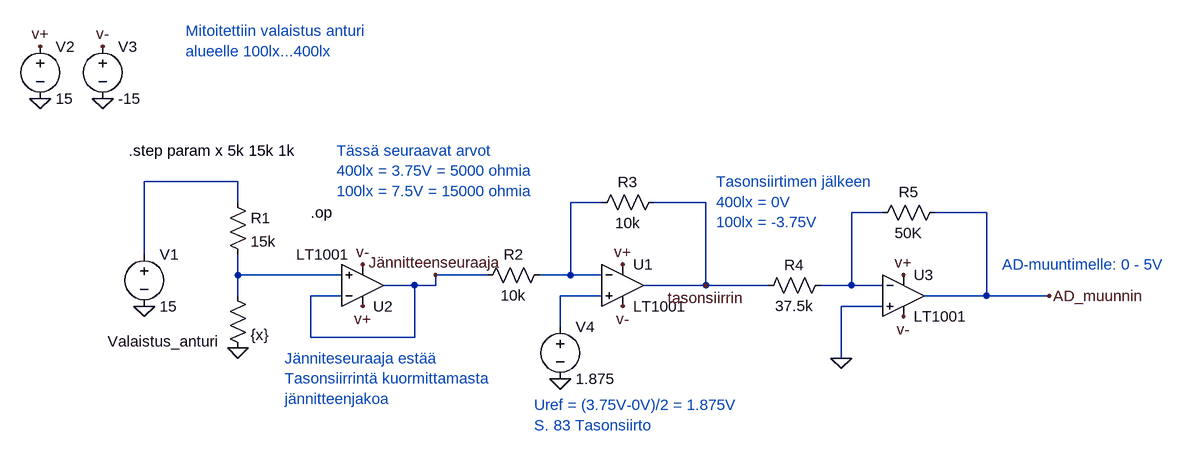
[diagram p0: schematic HT_teht4.asc]
HT_teht4.asc, the LTspice schematic file:
Version 4
SHEET 1 1972 680
WIRE -464 176 -608 176
WIRE -464 208 -464 176
WIRE 96 208 48 208
WIRE 256 208 176 208
WIRE 528 224 480 224
WIRE 688 224 608 224
WIRE -608 288 -608 176
WIRE -464 320 -464 288
WIRE -304 320 -464 320
WIRE -80 320 -160 320
WIRE 48 320 48 208
WIRE 48 320 0 320
WIRE 96 320 48 320
WIRE -192 336 -240 336
WIRE -160 336 -160 320
WIRE -160 336 -192 336
WIRE 256 336 256 208
WIRE 256 336 160 336
WIRE 352 336 256 336
WIRE 480 336 480 224
WIRE 480 336 432 336
WIRE 528 336 480 336
WIRE -464 352 -464 320
WIRE -304 352 -352 352
WIRE 96 352 32 352
WIRE 688 352 688 224
WIRE 688 352 592 352
WIRE 784 352 688 352
WIRE 528 368 464 368
WIRE 32 400 32 352
WIRE -352 416 -352 352
WIRE -192 416 -192 336
WIRE -192 416 -352 416
WIRE 464 448 464 368
FLAG -608 368 0
FLAG -464 432 0
FLAG -768 48 0
FLAG -672 48 0
FLAG 32 480 0
FLAG 128 368 v-
FLAG -672 -32 v-
FLAG 128 304 v+
FLAG -768 -32 v+
FLAG -272 368 v+
FLAG -272 304 v-
FLAG 560 384 v-
FLAG 560 320 v+
FLAG 464 448 0
FLAG 784 352 AD_muunnin
FLAG 256 336 tasonsiirrin
FLAG -160 320 Jännitteenseuraaja
SYMBOL res -480 192 R0
SYMATTR InstName R1
SYMATTR Value 15k
SYMBOL res -480 336 R0
WINDOW 0 -184 86 Left 2
SYMATTR InstName Valaistus_anturi
SYMATTR Value {x}
SYMBOL voltage -608 272 R0
WINDOW 123 0 0 Left 2
WINDOW 39 0 0 Left 2
SYMATTR InstName V1
SYMATTR Value 15
SYMBOL Opamps\\LT1001 128 272 R0
SYMATTR InstName U1
SYMBOL voltage -768 -48 R0
WINDOW 123 0 0 Left 2
WINDOW 39 0 0 Left 2
SYMATTR InstName V2
SYMATTR Value 15
SYMBOL voltage -672 -48 R0
WINDOW 123 0 0 Left 2
WINDOW 39 0 0 Left 2
SYMATTR InstName V3
SYMATTR Value -15
SYMBOL voltage 32 384 R0
WINDOW 123 0 0 Left 2
WINDOW 39 0 0 Left 2
SYMATTR InstName V4
SYMATTR Value 1.875
SYMBOL res 16 304 R90
WINDOW 0 0 56 VBottom 2
WINDOW 3 32 56 VTop 2
SYMATTR InstName R2
SYMATTR Value 10k
SYMBOL res 192 192 R90
WINDOW 0 0 56 VBottom 2
WINDOW 3 32 56 VTop 2
SYMATTR InstName R3
SYMATTR Value 10k
SYMBOL Opamps\\LT1001 -272 400 M180
WINDOW 3 -102 112 Left 2
SYMATTR InstName U2
SYMBOL Opamps\\LT1001 560 288 R0
SYMATTR InstName U3
SYMBOL res 448 320 R90
WINDOW 0 0 56 VBottom 2
WINDOW 3 32 56 VTop 2
SYMATTR InstName R4
SYMATTR Value 37.5k
SYMBOL res 624 208 R90
WINDOW 0 0 56 VBottom 2
WINDOW 3 32 56 VTop 2
SYMATTR InstName R5
SYMATTR Value 50K
TEXT -632 128 Left 2 !.step param x 5k 15k 1k
TEXT -352 224 Left 2 !.op
TEXT -544 -56 Left 2 ;Mitoitettiin valaistus anturi\nalueelle 100lx...400lx
TEXT -312 128 Left 2 ;Tässä seuraavat arvot\n400lx = 3.75V = 5000 ohmia\n100lx = 7.5V = 15000 ohmia
TEXT 272 176 Left 2 ;Tasonsiirtimen jälkeen\n400lx = 0V\n100lx = -3.75V
TEXT 712 304 Left 2 ;AD-muuntimelle: 0 - 5V
TEXT -392 448 Left 2 ;Jänniteseuraaja estää \nTasonsiirrintä kuormittamasta\njännitteenjakoa
TEXT -8 520 Left 2 ;Uref = (3.75V-0V)/2 = 1.875V\nS. 83 Tasonsiirto

The netlist it stands for:
* HT_teht4.asc
R1 N001 N004 15k
R§Valaistus_anturi N004 0 {x}
V1 N001 0 15
XU1 N005 N002 v+ v- tasonsiirrin LT1001  ; pins In+ In- V+ V- OUT
V2 v+ 0 15
V3 v- 0 -15
V4 N005 0 1.875
R2 N002 Jännitteenseuraaja 10k
R3 tasonsiirrin N002 10k
XU2 N004 Jännitteenseuraaja v+ v- Jännitteenseuraaja LT1001  ; pins In+ In- V+ V- OUT
XU3 0 N003 v+ v- AD_muunnin LT1001  ; pins In+ In- V+ V- OUT
R4 N003 tasonsiirrin 37.5k
R5 AD_muunnin N003 50K
.step param x 5k 15k 1k
.op
* Mitoitettiin valaistus anturi
* alueelle 100lx...400lx
* Tässä seuraavat arvot
* 400lx = 3.75V = 5000 ohmia
* 100lx = 7.5V = 15000 ohmia
* Tasonsiirtimen jälkeen
* 400lx = 0V
* 100lx = -3.75V
* AD-muuntimelle: 0 - 5V
* Jänniteseuraaja estää
* Tasonsiirrintä kuormittamasta
* jännitteenjakoa
* Uref = (3.75V-0V)/2 = 1.875V
* S. 83 Tasonsiirto
.lib LTC.lib
.backanno
.end

* Results of the author's LTspice run, read from the files saved beside the schematic
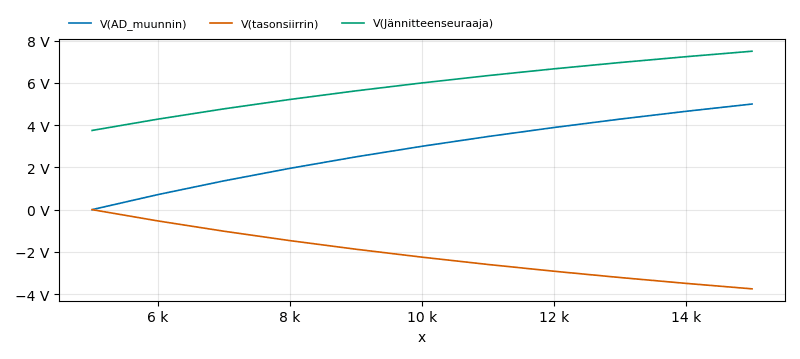
[diagram p1: Operating Point of HT_teht4.asc, plotted from the saved traces]
* Operating Point, 1 run:
*   V(AD_muunnin): -6.812 µV at x=5 k, 5 V at x=15 k, min -6.812 µV, max 5 V
*   V(tasonsiirrin): 5.109 µV at x=5 k, -3.75 V at x=15 k, min -3.75 V, max 5.109 µV
*   V(Jännitteenseuraaja): 3.75 V at x=5 k, 7.5 V at x=15 k, min 3.75 V, max 7.5 V
* From the log:
*   Semiconductor Device Operating Points:
*                           --- Diodes ---
*   Name:    d:u3:4      d:u3:1      d:u2:4      d:u2:1      d:u1:4
*   Model:    u3:di       u3:x        u2:di       u2:x        u1:di
*   Id:      9.14e-21    9.07e-21   -5.04e-15   -1.25e-14    8.46e-18
*   Vd:      9.13e-12    4.53e-09   -5.03e-06   -6.25e-03    8.45e-09
*   Req:     1.00e-09    1.00e-12    1.00e-09    1.00e-12    1.00e-09
*   CAP:     0.00e+00    0.00e+00    0.00e+00    0.00e+00    0.00e+00
*   Name:    d:u1:1
*   Model:    u1:x
*   Id:      1.25e-14
*   Vd:      6.25e-03
*   Req:     1.00e-12
*   CAP:     0.00e+00
*                           --- VDMOSFET Transistors ---
*   Name:        m:u3:2      m:u3:1      m:u2:2      m:u2:1      m:u1:2
*   Model:        u3:p        u3:n        u2:p        u2:n        u1:p
*   Id:         -2.25e-03    2.25e-03   -2.16e-03    2.34e-03   -2.34e-03
*   Vgs:        -4.54e-09   -4.54e-09    6.25e-03    6.25e-03   -6.25e-03
*   Vds:        -1.50e+01    1.50e+01   -1.87e+01    1.13e+01   -1.50e+01
*   Vth:         3.00e-01   -3.00e-01    3.00e-01   -3.00e-01    3.00e-01
*   Gm:          1.50e-02    1.50e-02    1.47e-02    1.53e-02    1.53e-02
*   Gds:         0.00e+00    0.00e+00    0.00e+00    0.00e+00    0.00e+00
*   Cgs:         0.00e+00    0.00e+00    0.00e+00    0.00e+00    0.00e+00
*   Cgd:         0.00e+00    0.00e+00    0.00e+00    0.00e+00    0.00e+00
*   Cbody:       0.00e+00    0.00e+00    0.00e+00    0.00e+00    0.00e+00
*   Name:        m:u1:1
*   Model:        u1:n
*   Id:          2.16e-03
*   Vgs:        -6.25e-03
*   Vds:         1.50e+01
*   Vth:        -3.00e-01
*   Gm:          1.47e-02
*   Gds:         0.00e+00
*   Cgs:         0.00e+00
*   Cgd:         0.00e+00
*   Cbody:       0.00e+00